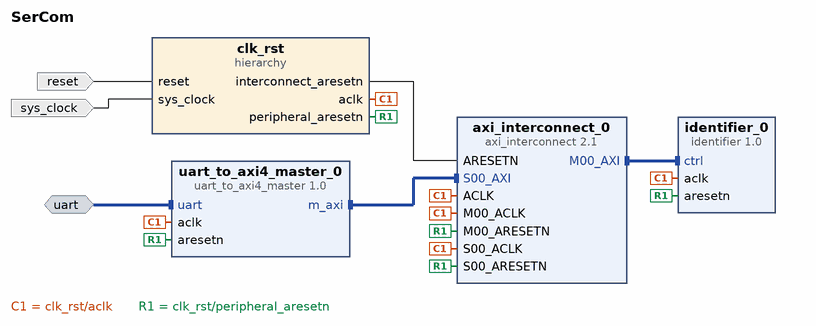
[diagram p0: block diagram of the top level]
# Vivado block design SerCom, xc7a35ticsg324-1L, Vivado 2022.2
create_bd_design SerCom

create_bd_intf_port -mode MirroredMaster -vlnv xilinx.com:interface:uart_rtl:1.0 uart
create_bd_port -dir I -type clk sys_clock
set_property -dict {CONFIG.FREQ_HZ 100000000 CONFIG.PHASE 0.0} [get_bd_ports sys_clock]
create_bd_port -dir I -type rst reset
set_property -dict {CONFIG.POLARITY ACTIVE_LOW} [get_bd_ports reset]

create_bd_cell -type ip -vlnv lvin:interfaces:uart_to_axi4_master:1.0 uart_to_axi4_master_0
set_property -dict {CONFIG.BAUD_RATE 1000000 CONFIG.BAUD_RATE_SIM 1000000} [get_bd_cells uart_to_axi4_master_0]
create_bd_cell -type ip -vlnv xilinx.com:ip:axi_interconnect:2.1 axi_interconnect_0
set_property -dict {CONFIG.NUM_MI 1} [get_bd_cells axi_interconnect_0]
create_bd_cell -type ip -vlnv lvin:versioning:identifier:1.0 identifier_0
set_property -dict {CONFIG.NAME {SerCom Demo}} [get_bd_cells identifier_0]
create_bd_cell -type hier clk_rst

# ---- hierarchy /clk_rst ----
current_bd_instance /clk_rst
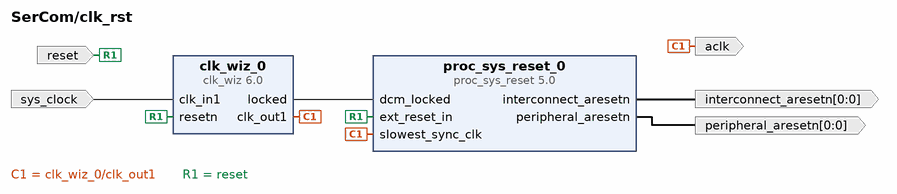
[diagram p1: block diagram inside /clk_rst]
create_bd_pin -dir I -type rst reset
create_bd_pin -dir I -type clk sys_clock
create_bd_pin -dir O -type clk aclk
create_bd_pin -dir O -from 0 -to 0 -type rst interconnect_aresetn
create_bd_pin -dir O -from 0 -to 0 -type rst peripheral_aresetn

create_bd_cell -type ip -vlnv xilinx.com:ip:clk_wiz:6.0 clk_wiz_0
set_property -dict [list \
  CONFIG.CLK_IN1_BOARD_INTERFACE sys_clock \
  CONFIG.RESET_BOARD_INTERFACE reset \
  CONFIG.RESET_PORT resetn \
  CONFIG.RESET_TYPE ACTIVE_LOW \
  CONFIG.USE_BOARD_FLOW true \
  CONFIG.USE_RESET true \
] [get_bd_cells clk_wiz_0]
create_bd_cell -type ip -vlnv xilinx.com:ip:proc_sys_reset:5.0 proc_sys_reset_0

# ---- connections ----

current_bd_instance /clk_rst
connect_bd_net [get_bd_pins clk_wiz_0/clk_out1] [get_bd_pins aclk] [get_bd_pins proc_sys_reset_0/slowest_sync_clk]
connect_bd_net [get_bd_pins clk_wiz_0/locked] [get_bd_pins proc_sys_reset_0/dcm_locked]
connect_bd_net [get_bd_pins proc_sys_reset_0/interconnect_aresetn] [get_bd_pins interconnect_aresetn]
connect_bd_net [get_bd_pins proc_sys_reset_0/peripheral_aresetn] [get_bd_pins peripheral_aresetn]
connect_bd_net [get_bd_pins reset] [get_bd_pins proc_sys_reset_0/ext_reset_in] [get_bd_pins clk_wiz_0/resetn]
connect_bd_net [get_bd_pins sys_clock] [get_bd_pins clk_wiz_0/clk_in1]

current_bd_instance /
connect_bd_intf_net [get_bd_intf_ports uart] [get_bd_intf_pins uart_to_axi4_master_0/uart]
connect_bd_intf_net [get_bd_intf_pins axi_interconnect_0/M00_AXI] [get_bd_intf_pins identifier_0/ctrl]
connect_bd_intf_net [get_bd_intf_pins uart_to_axi4_master_0/m_axi] [get_bd_intf_pins axi_interconnect_0/S00_AXI]
connect_bd_net -net clk_wiz_0_clk_out1 [get_bd_pins clk_rst/aclk] \
  [get_bd_pins uart_to_axi4_master_0/aclk] [get_bd_pins axi_interconnect_0/ACLK] [get_bd_pins axi_interconnect_0/S00_ACLK] \
  [get_bd_pins axi_interconnect_0/M00_ACLK] [get_bd_pins identifier_0/aclk]
connect_bd_net -net proc_sys_reset_0_interconnect_aresetn [get_bd_pins clk_rst/interconnect_aresetn] [get_bd_pins axi_interconnect_0/ARESETN]
connect_bd_net -net proc_sys_reset_0_peripheral_aresetn [get_bd_pins clk_rst/peripheral_aresetn] \
  [get_bd_pins axi_interconnect_0/M00_ARESETN] [get_bd_pins axi_interconnect_0/S00_ARESETN] \
  [get_bd_pins uart_to_axi4_master_0/aresetn] [get_bd_pins identifier_0/aresetn]
connect_bd_net [get_bd_ports reset] [get_bd_pins clk_rst/reset]
connect_bd_net [get_bd_ports sys_clock] [get_bd_pins clk_rst/sys_clock]

# ---- address map ----
assign_bd_address -offset 0x40000000 -range 4K -target_address_space [get_bd_addr_spaces uart_to_axi4_master_0/m_axi] [get_bd_addr_segs identifier_0/ctrl/reg0]

validate_bd_design
save_bd_design
